# Altium schematic sheet BTL_MCU.SchDoc: BTL_SmartHome
size A4; Organization: HCMUT; Address1: 268 Ly Thuong Kiet; Address2: Dien Hong Ward; Address3: HCMC; Address4: (+84) 98 380 3257; SheetNumber: 1; SheetTotal: 3
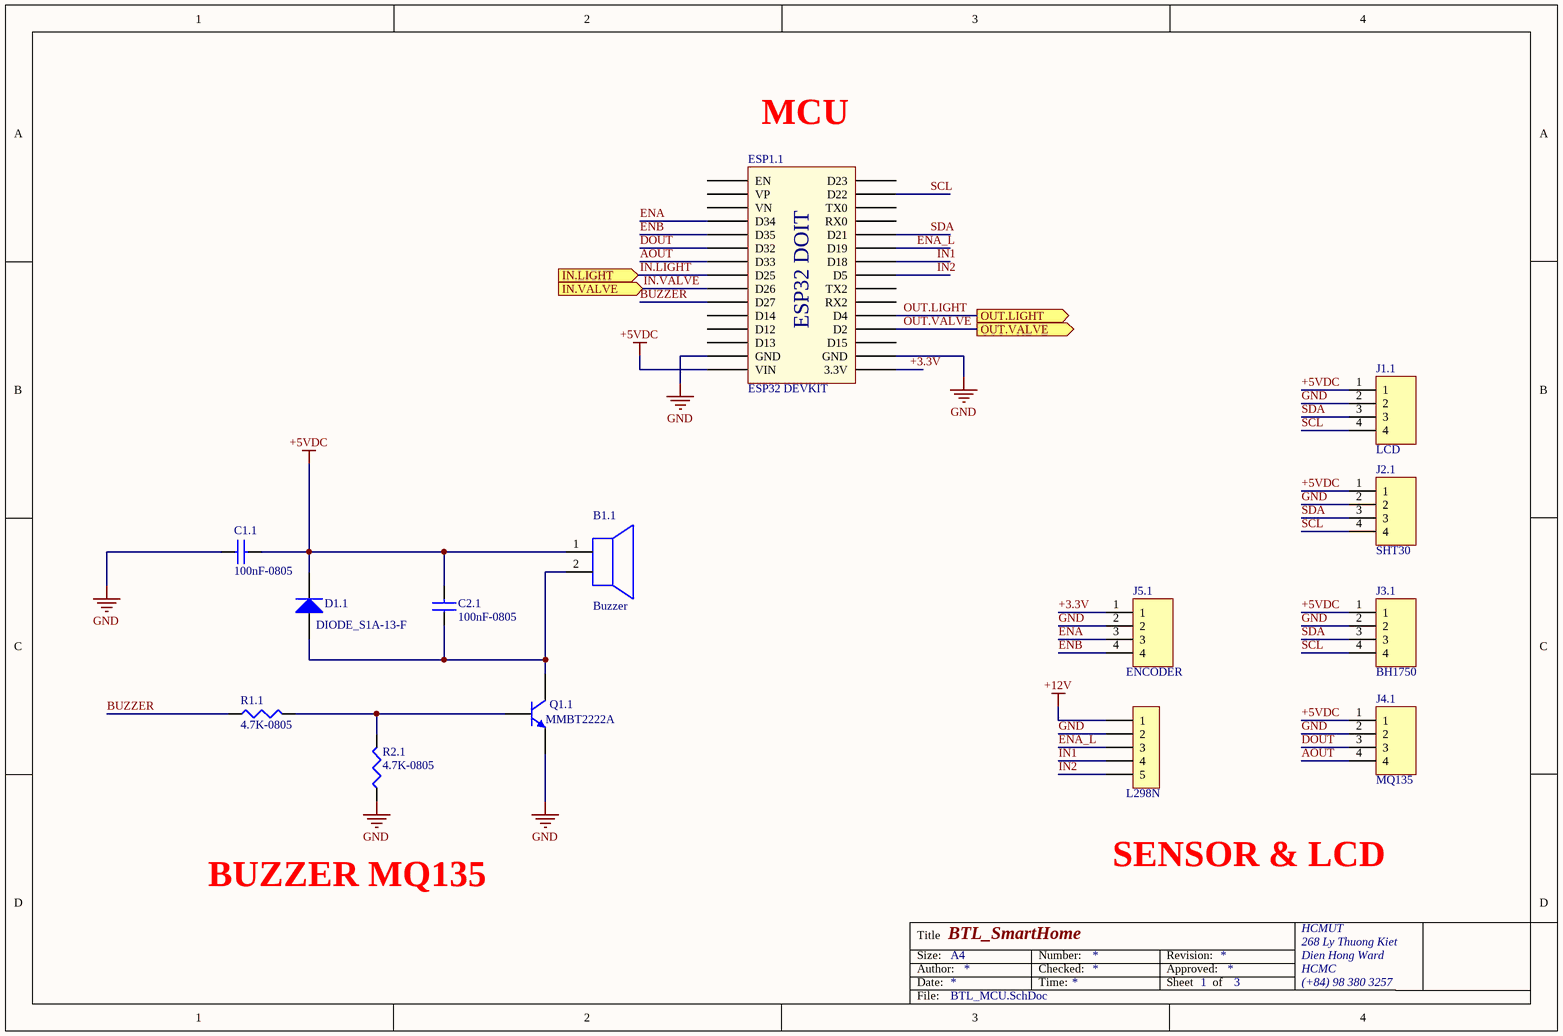
[diagram p0: BTL_MCU.SchDoc]

## Parts
B1.1  Buzzer  [Buzzer]
C1.1  100nF-0805  [CAP0805]
C2.1  100nF-0805  [CAP0805]
D1.1  DIODE_S1A-13-F  [DO-214AC]
ESP1.1  ESP32 DEVKIT  [ESP32 WROOM 32 KIT]
H1.1  L298N  [XH2.54M-5]
J1.1  LCD  [CON4_78_B4B-PH-K-S(LF)(SN)]
J2.1  SHT30  [CON4_78_B4B-PH-K-S(LF)(SN)]
J3.1  BH1750  [CON4_78_B4B-PH-K-S(LF)(SN)]
J4.1  MQ135  [CON4_78_B4B-PH-K-S(LF)(SN)]
J5.1  ENCODER  [CON4_78_B4B-PH-K-S(LF)(SN)]
Q1.1  MMBT2222A  [SOT23-3]
R1.1  4.7K-0805  [RES0805]
R2.1  4.7K-0805  [RES0805]

## Ports
IN.LIGHT (in), IN.VALVE (in), OUT.LIGHT (out), OUT.VALVE (out)

## Nets
+5VDC: B1.1.1(+) C1.1.2 C2.1.2 D1.1.2(K) ESP1.1.15(VIN) J1.1.1 J2.1.1 J3.1.1 J4.1.1
+12V: H1.1.1
GND: C1.1.1 ESP1.1.14(GND) ESP1.1.17(GND) H1.1.2 J1.1.2 J2.1.2 J3.1.2 J4.1.2 J5.1.2 Q1.1.2(E) R2.1.1
+3.3V: ESP1.1.16(3.3V) J5.1.1
AOUT: ESP1.1.7(D33) J4.1.4
BUZZER: ESP1.1.10(D27) R1.1.1
DOUT: ESP1.1.6(D32) J4.1.3
ENA: ESP1.1.4(D34) J5.1.3
ENA_L: ESP1.1.25(D19) H1.1.3
ENB: ESP1.1.5(D35) J5.1.4
IN1: ESP1.1.24(D18) H1.1.4
IN2: ESP1.1.23(D5) H1.1.5
IN.LIGHT: ESP1.1.8(D25) ; port IN.LIGHT
IN.VALVE: ESP1.1.9(D26) ; port IN.VALVE
OUT.LIGHT: ESP1.1.20(D4) ; port OUT.LIGHT
OUT.VALVE: ESP1.1.19(D2) ; port OUT.VALVE
SCL: ESP1.1.29(D22) J1.1.4 J2.1.4 J3.1.4
SDA: ESP1.1.26(D21) J1.1.3 J2.1.3 J3.1.3
NetB1.1_2: B1.1.2(-) C2.1.1 D1.1.1(A) Q1.1.3(C)
NetQ1.1_1: Q1.1.1(B) R1.1.2 R2.1.2

Not connected (* = marked no-connect by the designer): ESP1.1 1(EN) 2(VP) 3(VN) 11(D14) 12(D12) 13(D13) 18(D15) 21(RX2) 22(TX2) 27(RX0) 28(TX0) 30(D23)

## Notes on the sheet
- (near ESP1.1) MCU
- BUZZER MQ135
- SENSOR & LCD
- Title
- Size:
- Date:
- Author:
- A4
- Number:
- Time:
- Checked:
- Revision:
- Sheet
- Approved:
- of
- File:
- (in symbol ESP32 WROOM 32 KIT) ESP32 DOIT

## Library data of the parts
C1.1 C2.1 = CC0805JRNPO9BN300: CAP CER 30PF 50V NPO 0805; Manufacturer: Yageo; Tolerance: ±5%; Temperature Coefficient: C0G, NP0; Notification: Current market demand for these product types have resulted in fluctuating and extending lead times. Lead times may differ.; Supplier 1: Digi-Key; Manufacturer Part Number: CC0805JRNPO9BN300; RoHS: RoHS Compliant; Category: Capacitors; Stock 1: 0; Pricing 1: 1=0.15, 10=0.107, 100=0.0503, 500=0.03524, 1000=0.02918 (USD); Packaging: Cut Tape (CT); Part Status: Active; Voltage - Rated: 50V; Operating Temperature: -55°C ~ 125°C; Features: High Voltage; Ratings: -; Applications: General Purpose; Failure Rate: -; Mounting Type: Surface Mount, MLCC; Package / Case: 0805 (2012 Metric); Size / Dimension: 0.079" L x 0.049" W (2.00mm x 1.25mm); Height - Seated (Max): -; Thickness (Max): 0.028" (0.70mm); Lead Spacing: -; Lead Style: -; ComponentLink1URL: http://www.yageo.com/documents/recent/UPY-GP_NP0_16V-to-50V_16.pdf; ComponentLink1Description: http://www.yageo.com/documents/recent/UPY-GP_NP0_16V-to-50V_16.pdf; Supplier Part Number 1: 311-4234-1-ND
D1.1 = DIODE_S1A-13-F: DIODE GEN PURP 50V 1A SMA; Manufacturer: Diodes Incorporated; Diode Type: Standard; Speed: Standard Recovery >500ns, > 200mA (Io); Capacitance @ Vr, F: 10pF @ 4V, 1MHz; Supplier 1: Digi-Key; Manufacturer Part Number: S1A-13-F; RoHS: RoHS Compliant; Category: Discrete Semiconductor Products; Stock 1: 293435; Pricing 1: 1=0.27, 10=0.219, 100=0.1163, 500=0.07652, 1000=0.05203 (USD); Packaging: Digi-Reel®; Part Status: Active; Current - Average Rectified (Io): 1A; Mounting Type: Surface Mount; Package / Case: DO-214AC, SMA; Supplier Device Package: SMA; Operating Temperature - Junction: -65°C ~ 150°C; Base Part Number: S1A; ComponentLink1URL: https://www.diodes.com/assets/Datasheets/ds16003.pdf; ComponentLink1Description: https://www.diodes.com/assets/Datasheets/ds16003.pdf; Supplier Part Number 1: S1A-FDIDKR-ND
ESP1.1 = ESP32 WROOM 32 KIT
H1.1 = Header 5P 2.54 Duc Thang: Cắm; Ten_Linh_Kien: Header 5P XH2.54-5P Đực Thẳng; Don_Vi: Con; Ma_Hang: MH001298; Chung_Loai: Cắm
J1.1 J2.1 J3.1 J4.1 J5.1 = CON-PLG_4X1-78-ST-TH: Connector Header Through Hole 4 position 0.079" (2.00mm); Manufacturer Part Number: B4B-PH-K-S(LF)(SN); Manufacturer: JST; Mating Part Number: PHR-4; Crimp Part Number: ASPHSPH24K51; Alternate Part Number-1: NA; Case/Package: TH; Supplier-1: SP Road; Supplier Part Number-1: NA
Q1.1 = MMBT2222A: TRANS NPN 40V 1A SOT-23; Manufacturer: ON Semiconductor; Vce Saturation (Max) @ Ib, Ic: 1V @ 50mA, 500mA; Current - Collector Cutoff (Max): 10nA (ICBO); DC Current Gain (hFE) (Min) @ Ic, Vce: 100 @ 150mA, 10V; Frequency - Transition: 300MHz; Supplier 1: Digi-Key; Manufacturer Part Number: MMBT2222A; RoHS: RoHS Compliant; Category: Discrete Semiconductor Products; Stock 1: 220769; Pricing 1: 1=0.21, 10=0.17, 100=0.09, 500=0.05922, 1000=0.04027 (USD); Packaging: Cut Tape (CT); Part Status: Last Time Buy; Transistor Type: NPN; Operating Temperature: 150°C (TJ); Mounting Type: Surface Mount; Package / Case: TO-236-3, SC-59, SOT-23-3; Supplier Device Package: SOT-23-3; Base Part Number: MMBT2222; ComponentLink1URL: https://www.fairchildsemi.com/datasheets/MM/MMBT2222A.pdf; ComponentLink1Description: https://www.fairchildsemi.com/datasheets/MM/MMBT2222A.pdf; Supplier Part Number 1: MMBT2222AFSCT-ND
R1.1 R2.1 = AC0805JR-070RL: RES SMD 0.0OHM JUMPER 1/8W 0805; Manufacturer 1: Yageo; Category 1: Resistors; Resistance (Ohms): 0.0; Power (Watts): 0.125W, 1/8W; Value: 0R; Supplier 1: Digi-Key; Manufacturer Part Number 1: AC0805JR-070RL; RoHS 1: RoHS Compliant; Description 1: RES SMD 0.0OHM JUMPER 1/8W 0805; Stock 1: 16192; Pricing 1: 1=0.1, 10=0.03, 25=0.022, 50=0.0166, 100=0.0123, 250=0.00936, 500=0.00748, 1000=0.00551 (USD); Packaging: Cut Tape (CT); Part Status: Active; Tolerance: Jumper; Composition: Thick Film; Features: Automotive AEC-Q200, Moisture Resistant; Temperature Coefficient: -; Operating Temperature: -55°C ~ 155°C; Package / Case: 0805 (2012 Metric); Supplier Device Package: 0805; Size / Dimension: 0.079" L x 0.049" W (2.00mm x 1.25mm); Height - Seated (Max): 0.024" (0.60mm); Failure Rate: -; ComponentLink1URL: http://www.yageo.com/NewPortal/yageodocoutput?fileName=/pdf/R-Chip/PYu-AC_51_RoHS_L_5.pdf; ComponentLink1Description: http://www.yageo.com/NewPortal/yageodocoutput?fileName=/pdf/R-Chip/PYu-AC_51_RoHS_L_5.pdf; Supplier Part Number 1: YAG3755CT-ND